# Altium project Slot Card (Template) ver1.0.PrjPCB
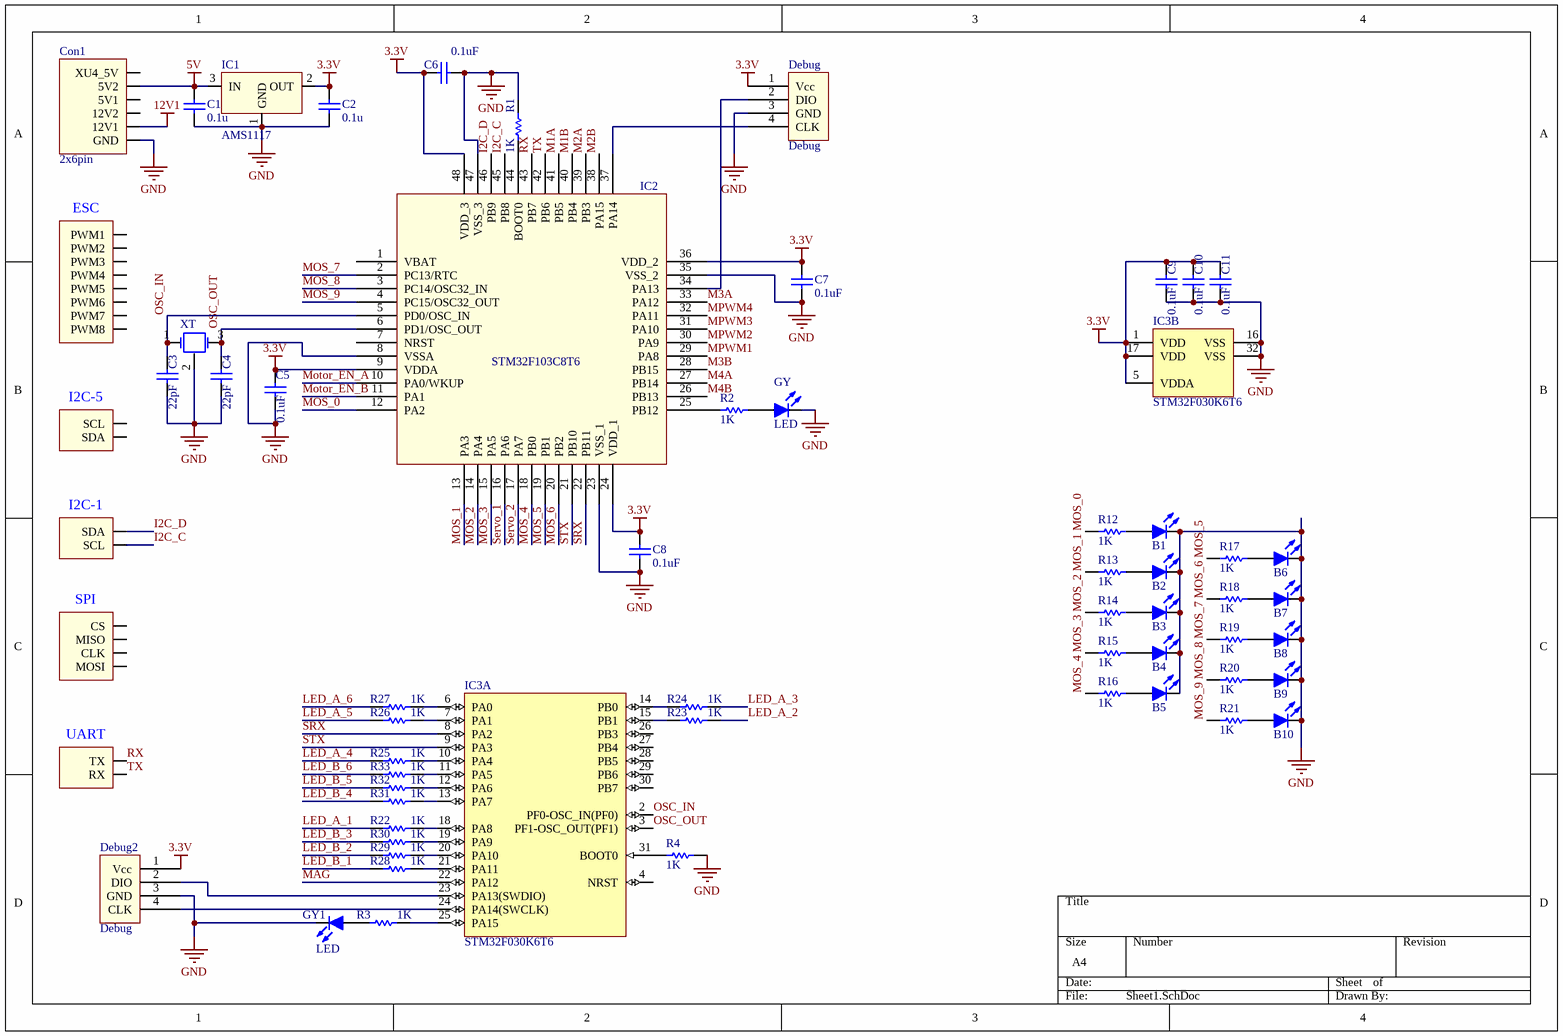
[diagram p0: Sheet1.SchDoc]
2 sheets, 145 parts. Net scope: global (net labels, ports and power ports of the same name join across sheets).
Board file: PCB1 - BU.PcbDoc
Sheets:
  Sheet1.SchDoc
  Sheet2.SchDoc

## Sheet Sheet1.SchDoc
size A4

### Parts
B1  LED  [LED-0805]  (value not drawn)
B2  LED  [LED-0805]  (value not drawn)
B3  LED  [LED-0805]  (value not drawn)
B4  LED  [LED-0805]  (value not drawn)
B5  LED  [LED-0805]  (value not drawn)
B6  LED  [LED-0805]  (value not drawn)
B7  LED  [LED-0805]  (value not drawn)
B8  LED  [LED-0805]  (value not drawn)
B9  LED  [LED-0805]  (value not drawn)
B10  LED  [LED-0805]  (value not drawn)
C1  0.1u  [C0805]
C2  0.1u  [C0805]
C3  22pF  [C0805]
C4  22pF  [C0805]
C5  0.1uF  [C0805]
C6  0.1uF  [C0805]
C7  0.1uF  [C0805]
C8  0.1uF  [C0805]
C9  0.1uF  [C0805]
C10  0.1uF  [C0805]
C11  0.1uF  [C0805]
Con1  2x6pin  [2x6pin]
Con2  2x10pin  [2x10pin]  (value not drawn)  (parts A,B,C,D,E of 5)
Debug  Debug  [Debug_SMD]
Debug2  Debug  [Debug_SMD]
GY  LED  [LED-0805]
GY1  LED  [LED-0805]
IC1  AMS1117  [SOT-223]
IC2  STM32F103C8T6  [LQFP48]
IC3  STM32F030K6T6  [LQFP-32]  (parts A,B of 2)
R1  1K  [R0805]
R2  1K  [R0805]
R3  1K  [R0805]
R4  1K  [R0805]
R12  1K  [R0805]
R13  1K  [R0805]
R14  1K  [R0805]
R15  1K  [R0805]
R16  1K  [R0805]
R17  1K  [R0805]
R18  1K  [R0805]
R19  1K  [R0805]
R20  1K  [R0805]
R21  1K  [R0805]
R22  1K  [R0805]
R23  1K  [R0805]
R24  1K  [R0805]
R25  1K  [R0805]
R26  1K  [R0805]
R27  1K  [R0805]
R28  1K  [R0805]
R29  1K  [R0805]
R30  1K  [R0805]
R31  1K  [R0805]
R32  1K  [R0805]
R33  1K  [R0805]
XT  8MHz  [3225-P]  (value not drawn)

### Nets
3.3V: C2.2 C5.2 C6.1 C7.2 C8.2 C9.2 C10.2 C11.2 Debug.1(Vcc) Debug2.1(Vcc) IC1.2(OUT) IC2.9(VDDA) IC2.24(VDD_1) IC2.36(VDD_2) IC2.48(VDD_3) IC3.1(VDD) IC3.5(VDDA) IC3.17(VDD)
5V: C1.2 Con1.2(5V2) IC1.3(IN)
12V1: Con1.5(12V1)  [project net 5]
GND: B1.2(K) B2.2(K) B3.2(K) B4.2(K) B5.2(K) B6.2(K) B7.2(K) B8.2(K) B9.2(K) B10.2(K) C1.1 C2.1 C3.2 C4.2 C5.1 C6.2 C7.1 C8.1 C9.1 C10.1 C11.1 Con1.6(GND) Debug.3(GND) Debug2.3(GND) GY.2(K) GY1.2(K) IC1.1(GND) IC2.8(VSSA) IC2.23(VSS_1) IC2.35(VSS_2) IC2.47(VSS_3) IC3.16(VSS) IC3.32(VSS) R1.2 R4.2 XT.2
I2C_C: Con2.14(SCL) IC2.45(PB8)
I2C_D: Con2.13(SDA) IC2.46(PB9)
LED_A_1: R22.1
LED_A_2: R23.2
LED_A_3: R24.2
LED_A_4: R25.1
LED_A_5: R26.1
LED_A_6: R27.1
LED_B_1: R28.1
LED_B_2: R29.1
LED_B_3: R30.1
LED_B_4: R31.1
LED_B_5: R32.1
LED_B_6: R33.1
M1A: IC2.41(PB5)
M1B: IC2.40(PB4)
M2A: IC2.39(PB3)
M2B: IC2.38(PA15)
M3A: IC2.33(PA12)
M3B: IC2.28(PB15)
M4A: IC2.27(PB14)
M4B: IC2.26(PB13)
MAG: IC3.22(PA12)
MOS_0: IC2.12(PA2) R12.1
MOS_1: IC2.13(PA3) R13.1
MOS_2: IC2.14(PA4) R14.1
MOS_3: IC2.15(PA5) R15.1
MOS_4: IC2.18(PB0) R16.1
MOS_5: IC2.19(PB1) R17.1
MOS_6: IC2.20(PB2) R18.1
MOS_7: IC2.2(PC13/RTC) R19.1
MOS_8: IC2.3(PC14/OSC32_IN) R20.1
MOS_9: IC2.4(PC15/OSC32_OUT) R21.1
Motor_EN_A: IC2.10(PA0/WKUP)
Motor_EN_B: IC2.11(PA1)
MPWM1: IC2.29(PA8)
MPWM2: IC2.30(PA9)
MPWM3: IC2.31(PA10)
MPWM4: IC2.32(PA11)
OSC_IN: C3.1 IC2.5(PD0/OSC_IN) IC3.2(PF0-OSC_IN(PF0)) XT.1(OSC1)
OSC_OUT: C4.1 IC2.6(PD1/OSC_OUT) IC3.3(PF1-OSC_OUT(PF1)) XT.3(OSC2)
RX: Con2.19(TX) IC2.43(PB7)
Servo_1: IC2.16(PA6)
Servo_2: IC2.17(PA7)
SRX: IC2.22(PB11) IC3.8(PA2)
STX: IC2.21(PB10) IC3.9(PA3)
TX: Con2.20(RX) IC2.42(PB6)
NetB1_1: B1.1(A) R12.2
NetB2_1: B2.1(A) R13.2
NetB3_1: B3.1(A) R14.2
NetB4_1: B4.1(A) R15.2
NetB5_1: B5.1(A) R16.2
NetB6_1: B6.1(A) R17.2
NetB7_1: B7.1(A) R18.2
NetB8_1: B8.1(A) R19.2
NetB9_1: B9.1(A) R20.2
NetB10_1: B10.1(A) R21.2
NetDebug2_2: Debug2.2(DIO) IC3.23(PA13(SWDIO))
NetDebug2_4: Debug2.4(CLK) IC3.24(PA14(SWCLK))
NetDebug_2: Debug.2(DIO) IC2.34(PA13)
NetDebug_4: Debug.4(CLK) IC2.37(PA14)
NetGY1_1: GY1.1(A) R3.1
NetGY_1: GY.1(A) R2.2
NetIC2_25: IC2.25(PB12) R2.1
NetIC2_44: IC2.44(BOOT0) R1.1
NetIC3_6: IC3.6(PA0) R27.2
NetIC3_7: IC3.7(PA1) R26.2
NetIC3_10: IC3.10(PA4) R25.2
NetIC3_11: IC3.11(PA5) R33.2
NetIC3_12: IC3.12(PA6) R32.2
NetIC3_13: IC3.13(PA7) R31.2
NetIC3_14: IC3.14(PB0) R24.1
NetIC3_15: IC3.15(PB1) R23.1
NetIC3_18: IC3.18(PA8) R22.2
NetIC3_19: IC3.19(PA9) R30.2
NetIC3_20: IC3.20(PA10) R29.2
NetIC3_21: IC3.21(PA11) R28.2
NetIC3_25: IC3.25(PA15) R3.2
NetIC3_31: IC3.31(BOOT0) R4.1

Not connected (* = marked no-connect by the designer): Con1 1(XU4_5V) 3(5V1) 4(12V2); Con2 1(PWM1) 2(PWM2) 3(PWM3) 4(PWM4) 5(PWM5) 6(PWM6) 7(PWM7) 8(PWM8) 11(SCL) 12(SDA) 15(CS) 16(MISO) 17(CLK) 18(MOSI); IC2 1(VBAT) 7(NRST); IC3 4(NRST) 26(PB3) 27(PB4) 28(PB5) 29(PB6) 30(PB7)

### Notes on the sheet
- (in symbol 2x10pin, part A) ESC
- (in symbol 2x10pin, part B) I2C-5
- (in symbol 2x10pin, part C) I2C-1
- (in symbol 2x10pin, part D) SPI
- (in symbol 2x10pin, part E) UART

### Library data of the parts
C1 C2 C9-C11 = Cap: value: *
C3-C8 = Capacitor: value: *
IC3 = STM32F030K6T6: ARM Cortex-M0 32-bit MCU, 32 KB Flash, 4 KB Internal RAM, 26 I/Os, 32-pin LQFP, -40 to 85 degC, Tray; FLASH Size (Prog) (kB): 32; I/Os (High Current): 26; Internal RAM Size (kB): 4; Operating Frequency(F) (Processor speed) (MHz): 48; Supply Voltage(Vcc) min (V): 2.4; DatasheetVersion: Rev. 1; PackageVersion: Rev. 1, 07/2013; PackageReference: LQFP32; PackageDescription: 32-Pin Low Profile Quad Flat Package, 7 x 7 mm Body, 0.8 mm Pitch; Supplier 1: Digi-Key; Supplier Part Number 1: 497-14046-ND; Supplier 2: Newark; Supplier Part Number 2: 19X6194; Supplier 3: Mouser; Supplier Part Number 3: 511-STM32F030K6T6; Core: ARM Cortex-M0; Packing: Tray; Mounting Technology: Surface Mount; PartNumber: STM32F030K6T6; ComponentLink1Description: Manufacturer URL; ComponentLink1URL: http://www.st.com/web/en/home.html; ComponentLink2Description: Datasheet; ComponentLink2URL: http://www.st.com/st-web-ui/static/active/en/resource/technical/document/datasheet/DM00088500.pdf; ComponentLink3Description: Package Specification; ComponentLink3URL: http://www.st.com/st-web-ui/static/active/en/resource/technical/document/datasheet/DM00088500.pdf
R1-R4 R12-R33 = Resistor: value: *
XT = Passive Crystal: frequency: *

## Sheet Sheet2.SchDoc
size A4
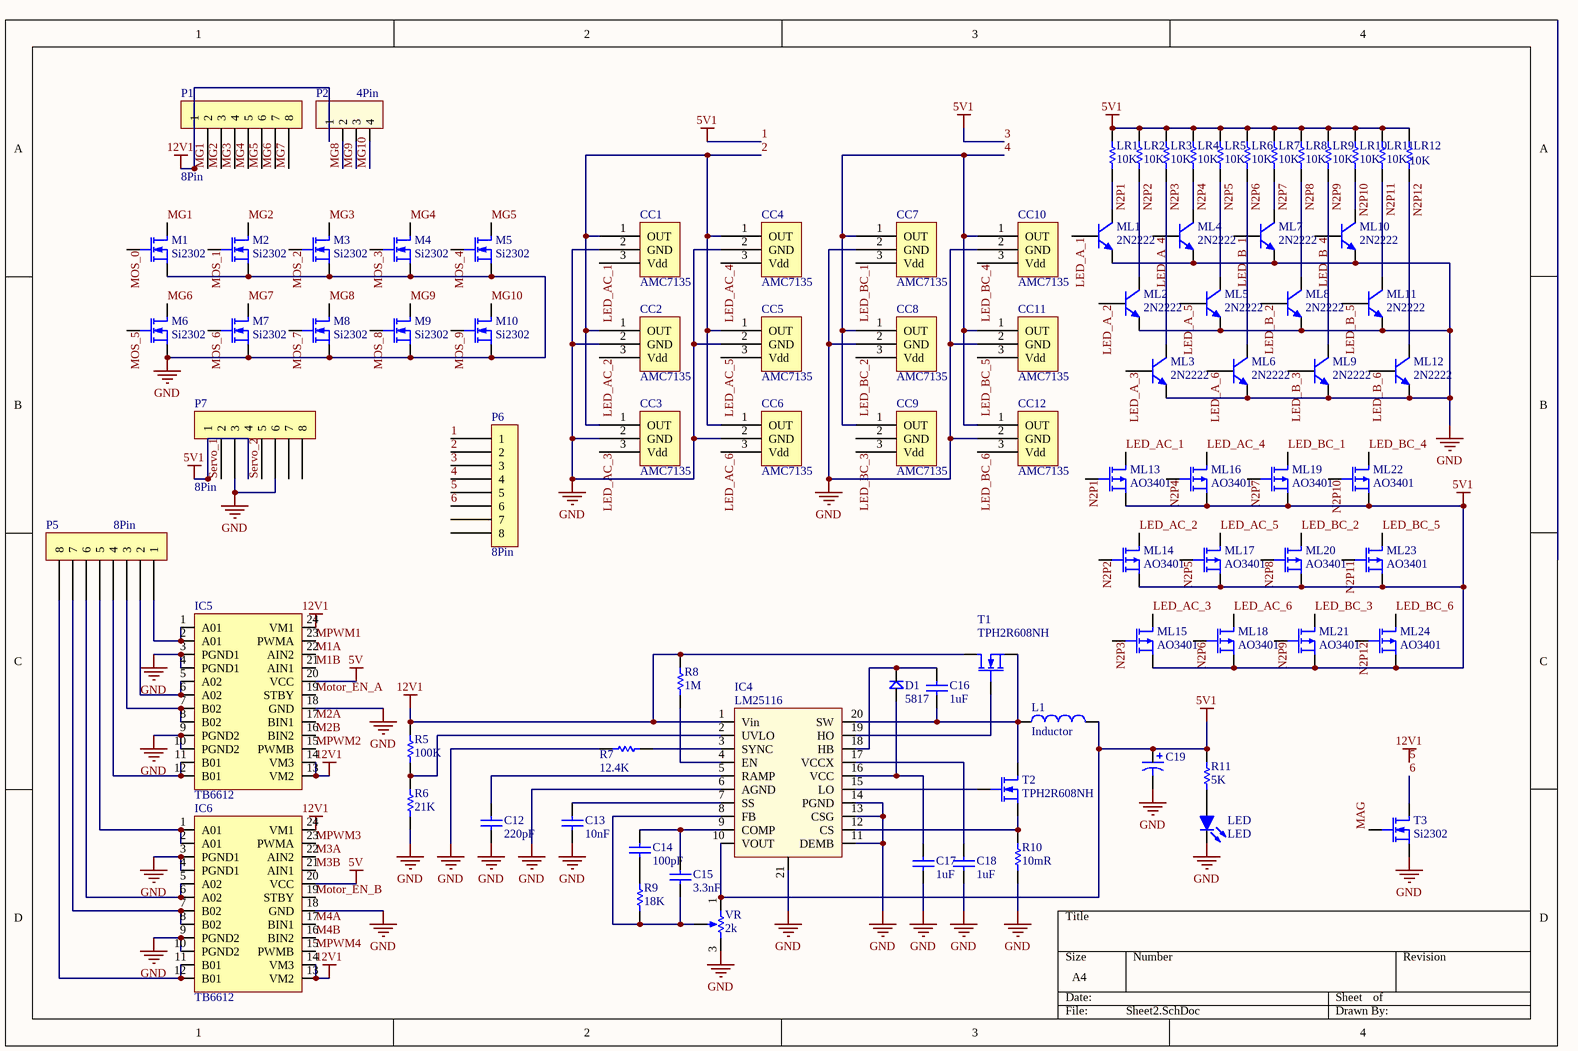
[diagram p1: Sheet2.SchDoc]

### Parts
C12  220pF  [C0805]
C13  10nF  [C0805]
C14  100pF  [C0805]
C15  3.3nF  [C0805]
C16  1uF  [C0805]
C17  1uF  [C0805]
C18  1uF  [C0805]
C19  *  [Cap SMD 10x12.7mm]  (value not drawn)
CC1  AMC7135  [SOT89-150P410X160-3L]
CC2  AMC7135  [SOT89-150P410X160-3L]
CC3  AMC7135  [SOT89-150P410X160-3L]
CC4  AMC7135  [SOT89-150P410X160-3L]
CC5  AMC7135  [SOT89-150P410X160-3L]
CC6  AMC7135  [SOT89-150P410X160-3L]
CC7  AMC7135  [SOT89-150P410X160-3L]
CC8  AMC7135  [SOT89-150P410X160-3L]
CC9  AMC7135  [SOT89-150P410X160-3L]
CC10  AMC7135  [SOT89-150P410X160-3L]
CC11  AMC7135  [SOT89-150P410X160-3L]
CC12  AMC7135  [SOT89-150P410X160-3L]
D1  5817  [Diode-SOD-323]
IC4  LM25116  [HTSSOP-20]
IC5  TB6612  [SSOP24]
IC6  TB6612  [SSOP24]
L1  Inductor  [Inductor-CDEP147]
LED  LED  [LED-0805]
LR1  10K  [R0805]
LR2  10K  [R0805]
LR3  10K  [R0805]
LR4  10K  [R0805]
LR5  10K  [R0805]
LR6  10K  [R0805]
LR7  10K  [R0805]
LR8  10K  [R0805]
LR9  10K  [R0805]
LR10  10K  [R0805]
LR11  10K  [R0805]
LR12  10K  [R0805]
M1  Si2302  [SOT23]
M2  Si2302  [SOT23]
M3  Si2302  [SOT23]
M4  Si2302  [SOT23]
M5  Si2302  [SOT23]
M6  Si2302  [SOT23]
M7  Si2302  [SOT23]
M8  Si2302  [SOT23]
M9  Si2302  [SOT23]
M10  Si2302  [SOT23]
ML1  2N2222  [SOT23]
ML2  2N2222  [SOT23]
ML3  2N2222  [SOT23]
ML4  2N2222  [SOT23]
ML5  2N2222  [SOT23]
ML6  2N2222  [SOT23]
ML7  2N2222  [SOT23]
ML8  2N2222  [SOT23]
ML9  2N2222  [SOT23]
ML10  2N2222  [SOT23]
ML11  2N2222  [SOT23]
ML12  2N2222  [SOT23]
ML13  AO3401  [SOT23]
ML14  AO3401  [SOT23]
ML15  AO3401  [SOT23]
ML16  AO3401  [SOT23]
ML17  AO3401  [SOT23]
ML18  AO3401  [SOT23]
ML19  AO3401  [SOT23]
ML20  AO3401  [SOT23]
ML21  AO3401  [SOT23]
ML22  AO3401  [SOT23]
ML23  AO3401  [SOT23]
ML24  AO3401  [SOT23]
P1  8Pin  [XH2.54-8pin_SMD]
P2  4Pin  [XH2.54-4pin_SMD]
P5  8Pin  [XH2.54-8pin_SMD]
P6  8Pin  [XH2.54-8pin_SMD]
P7  8Pin  [XH2.54-8pin_SMD]
R5  100K  [R0805]
R6  21K  [R0805]
R7  12.4K  [R0805]
R8  1M  [R0805]
R9  18K  [R0805]
R10  10mR  [R2010]
R11  5K  [R0805]
T1  TPH2R608NH  [TPH2R608NH]
T2  TPH2R608NH  [TPH2R608NH]
T3  Si2302  [SOT23]
VR  2k  [3224W-1-202E]

### Nets
1: C19.1 IC4.10(VOUT) L1.2 LR1.2 LR2.2 LR3.2 LR4.2 LR5.2 LR6.2 LR7.2 LR8.2 LR9.2 LR10.2 LR11.2 LR12.2 ML13.2(S) ML14.2(S) ML15.2(S) ML16.2(S) ML17.2(S) ML18.2(S) ML19.2(S) ML20.2(S) ML21.2(S) ML22.2(S) ML23.2(S) ML24.2(S) P6.1 P6.3 P7.1 P7.4 R11.2 VR.1(TOP)  [also labelled 3, 5V1]
5: IC4.1(Vin) IC5.13(VM2) IC5.14(VM3) IC5.24(VM1) IC6.13(VM2) IC6.14(VM3) IC6.24(VM1) P1.1 P2.1 P6.5 R5.2 R8.2 T1.1(D)  [also labelled 12V1]
5V: IC5.20(VCC) IC6.20(VCC)
GND: C12.1 C13.1 C17.1 C18.1 C19.2 CC1.2(GND) CC2.2(GND) CC3.2(GND) CC4.2(GND) CC5.2(GND) CC6.2(GND) CC7.2(GND) CC8.2(GND) CC10.2(GND) CC11.2(GND) CC12.2(GND) IC4.6(AGND) IC4.11(DEMB) IC4.13(CSG) IC4.14(PGND) IC4.21 IC5.3(PGND1) IC5.4(PGND1) IC5.9(PGND2) IC5.10(PGND2) IC5.18(GND) IC6.3(PGND1) IC6.4(PGND1) IC6.9(PGND2) IC6.10(PGND2) IC6.18(GND) LED.2(K) M1.2(S) M2.2(S) M3.2(S) M4.2(S) M5.2(S) M6.2(S) M7.2(S) M8.2(S) M9.2(S) M10.2(S) ML1.2(E) ML2.2(E) ML3.2(E) ML4.2(E) ML5.2(E) ML6.2(E) ML7.2(E) ML8.2(E) ML9.2(E) ML10.2(E) ML11.2(E) ML12.2(E) P7.3 P7.6 R6.1 R7.1 R10.1 T3.2(S) VR.3(BOT)
2: CC1.1(OUT) CC2.1(OUT) CC3.1(OUT) CC4.1(OUT) CC5.1(OUT) CC6.1(OUT) P6.2
4: CC7.1(OUT) CC8.1(OUT) CC9.1(OUT) CC10.1(OUT) CC11.1(OUT) CC12.1(OUT) P6.4
6: P6.6 T3.3(D)
LED_A_1: ML1.1(B)
LED_A_2: ML2.1(B)
LED_A_3: ML3.1(B)
LED_A_4: ML4.1(B)
LED_A_5: ML5.1(B)
LED_A_6: ML6.1(B)
LED_AC_1: CC1.3(Vdd) ML13.3(D)
LED_AC_2: CC2.3(Vdd) ML14.3(D)
LED_AC_3: CC3.3(Vdd) ML15.3(D)
LED_AC_4: CC4.3(Vdd) ML16.3(D)
LED_AC_5: CC5.3(Vdd) ML17.3(D)
LED_AC_6: CC6.3(Vdd) ML18.3(D)
LED_B_1: ML7.1(B)
LED_B_2: ML8.1(B)
LED_B_3: ML9.1(B)
LED_B_4: ML10.1(B)
LED_B_5: ML11.1(B)
LED_B_6: ML12.1(B)
LED_BC_1: CC7.3(Vdd) ML19.3(D)
LED_BC_2: CC8.3(Vdd) ML20.3(D)
LED_BC_3: CC9.3(Vdd) ML21.3(D)
LED_BC_4: CC10.3(Vdd) ML22.3(D)
LED_BC_5: CC11.3(Vdd) ML23.3(D)
LED_BC_6: CC12.3(Vdd) ML24.3(D)
M1A: IC5.22(AIN2)
M1B: IC5.21(AIN1)
M2A: IC5.17(BIN1)
M2B: IC5.16(BIN2)
M3A: IC6.22(AIN2)
M3B: IC6.21(AIN1)
M4A: IC6.17(BIN1)
M4B: IC6.16(BIN2)
MAG: T3.1(G)
MG1: M1.3(D) P1.2
MG2: M2.3(D) P1.3
MG3: M3.3(D) P1.4
MG4: M4.3(D) P1.5
MG5: M5.3(D) P1.6
MG6: M6.3(D) P1.7
MG7: M7.3(D) P1.8
MG8: M8.3(D) P2.2
MG9: M9.3(D) P2.3
MG10: M10.3(D) P2.4
MOS_0: M1.1(G)
MOS_1: M2.1(G)
MOS_2: M3.1(G)
MOS_3: M4.1(G)
MOS_4: M5.1(G)
MOS_5: M6.1(G)
MOS_6: M7.1(G)
MOS_7: M8.1(G)
MOS_8: M9.1(G)
MOS_9: M10.1(G)
Motor_EN_A: IC5.19(STBY)
Motor_EN_B: IC6.19(STBY)
MPWM1: IC5.23(PWMA)
MPWM2: IC5.15(PWMB)
MPWM3: IC6.23(PWMA)
MPWM4: IC6.15(PWMB)
N2P1: LR1.1 ML1.3(C) ML13.1(G)
N2P2: LR2.1 ML2.3(C) ML14.1(G)
N2P3: LR3.1 ML3.3(C) ML15.1(G)
N2P4: LR4.1 ML4.3(C) ML16.1(G)
N2P5: LR5.1 ML5.3(C) ML17.1(G)
N2P6: LR6.1 ML6.3(C) ML18.1(G)
N2P7: LR7.1 ML7.3(C) ML19.1(G)
N2P8: LR8.1 ML8.3(C) ML20.1(G)
N2P9: LR9.1 ML9.3(C) ML21.1(G)
N2P10: LR10.1 ML10.3(C) ML22.1(G)
N2P11: LR11.1 ML11.3(C) ML23.1(G)
N2P12: LR12.1 ML12.3(C) ML24.1(G)
Servo_1: P7.2
Servo_2: P7.5
NetC12_2: C12.2 IC4.5(RAMP)
NetC13_2: C13.2 IC4.7(SS)
NetC14_1: C14.1 R9.2
NetC14_2: C14.2 C15.2 IC4.9(COMP)
NetC15_1: C15.1 IC4.8(FB) R9.1 VR.2(TAP)
NetC16_1: C16.1 IC4.20(SW) L1.1 T1.3(S) T2.1(D)
NetC16_2: C16.2 D1.2(KATHODE) IC4.18(HB)
NetC17_2: C17.2 D1.1(ANODE) IC4.16(VCC)
NetC18_2: C18.2 IC4.17(VCCX)
NetIC4_2: IC4.2(UVLO) R5.1 R6.2
NetIC4_3: IC4.3(SYNC) R7.2
NetIC4_4: IC4.4(EN) R8.1
NetIC4_12: IC4.12(CS) R10.2 T2.3(S)
NetIC4_15: IC4.15(LO) T2.2(G)
NetIC4_19: IC4.19(HO) T1.2(G)
NetIC5_1: IC5.1(A01) IC5.2(A01) P5.1
NetIC5_5: IC5.5(A02) IC5.6(A02) P5.2
NetIC5_7: IC5.7(B02) IC5.8(B02) P5.3
NetIC5_11: IC5.11(B01) IC5.12(B01) P5.4
NetIC6_1: IC6.1(A01) IC6.2(A01) P5.5
NetIC6_5: IC6.5(A02) IC6.6(A02) P5.6
NetIC6_7: IC6.7(B02) IC6.8(B02) P5.7
NetIC6_11: IC6.11(B01) IC6.12(B01) P5.8
NetLED_1: LED.1(A) R11.1

Not connected (* = marked no-connect by the designer): CC9 2(GND); P6 7 8; P7 7 8

### Library data of the parts
C12-C18 = Cap: value: *
C19 = Cap-pol: value: *
D1 = Diode
IC4 = LM25116: Buck Controller
LR1-LR12 R5-R11 = Resistor
  LR1-LR12 R5-R9 R11: value: *
  R10: value: 10mR
ML1-ML12 = 2N2222: NPN
T1 T2 = MOSFET-N
VR = Potentiometer

## Nets that join several sheets
5: Sheet1 (Con1.5), Sheet2 (13 pins)
5V: Sheet1 (C1.2 Con1.2 IC1.3), Sheet2 (IC5.20 IC6.20)
GND: Sheet1 (36 pins), Sheet2 (61 pins)
LED_A_1: Sheet1 (R22.1), Sheet2 (ML1.1)
LED_A_2: Sheet1 (R23.2), Sheet2 (ML2.1)
LED_A_3: Sheet1 (R24.2), Sheet2 (ML3.1)
LED_A_4: Sheet1 (R25.1), Sheet2 (ML4.1)
LED_A_5: Sheet1 (R26.1), Sheet2 (ML5.1)
LED_A_6: Sheet1 (R27.1), Sheet2 (ML6.1)
LED_B_1: Sheet1 (R28.1), Sheet2 (ML7.1)
LED_B_2: Sheet1 (R29.1), Sheet2 (ML8.1)
LED_B_3: Sheet1 (R30.1), Sheet2 (ML9.1)
LED_B_4: Sheet1 (R31.1), Sheet2 (ML10.1)
LED_B_5: Sheet1 (R32.1), Sheet2 (ML11.1)
LED_B_6: Sheet1 (R33.1), Sheet2 (ML12.1)
M1A: Sheet1 (IC2.41), Sheet2 (IC5.22)
M1B: Sheet1 (IC2.40), Sheet2 (IC5.21)
M2A: Sheet1 (IC2.39), Sheet2 (IC5.17)
M2B: Sheet1 (IC2.38), Sheet2 (IC5.16)
M3A: Sheet1 (IC2.33), Sheet2 (IC6.22)
M3B: Sheet1 (IC2.28), Sheet2 (IC6.21)
M4A: Sheet1 (IC2.27), Sheet2 (IC6.17)
M4B: Sheet1 (IC2.26), Sheet2 (IC6.16)
MAG: Sheet1 (IC3.22), Sheet2 (T3.1)
MOS_0: Sheet1 (IC2.12 R12.1), Sheet2 (M1.1)
MOS_1: Sheet1 (IC2.13 R13.1), Sheet2 (M2.1)
MOS_2: Sheet1 (IC2.14 R14.1), Sheet2 (M3.1)
MOS_3: Sheet1 (IC2.15 R15.1), Sheet2 (M4.1)
MOS_4: Sheet1 (IC2.18 R16.1), Sheet2 (M5.1)
MOS_5: Sheet1 (IC2.19 R17.1), Sheet2 (M6.1)
MOS_6: Sheet1 (IC2.20 R18.1), Sheet2 (M7.1)
MOS_7: Sheet1 (IC2.2 R19.1), Sheet2 (M8.1)
MOS_8: Sheet1 (IC2.3 R20.1), Sheet2 (M9.1)
MOS_9: Sheet1 (IC2.4 R21.1), Sheet2 (M10.1)
Motor_EN_A: Sheet1 (IC2.10), Sheet2 (IC5.19)
Motor_EN_B: Sheet1 (IC2.11), Sheet2 (IC6.19)
MPWM1: Sheet1 (IC2.29), Sheet2 (IC5.23)
MPWM2: Sheet1 (IC2.30), Sheet2 (IC5.15)
MPWM3: Sheet1 (IC2.31), Sheet2 (IC6.23)
MPWM4: Sheet1 (IC2.32), Sheet2 (IC6.15)
Servo_1: Sheet1 (IC2.16), Sheet2 (P7.2)
Servo_2: Sheet1 (IC2.17), Sheet2 (P7.5)